# Altium project OpenDriver.PrjPCB
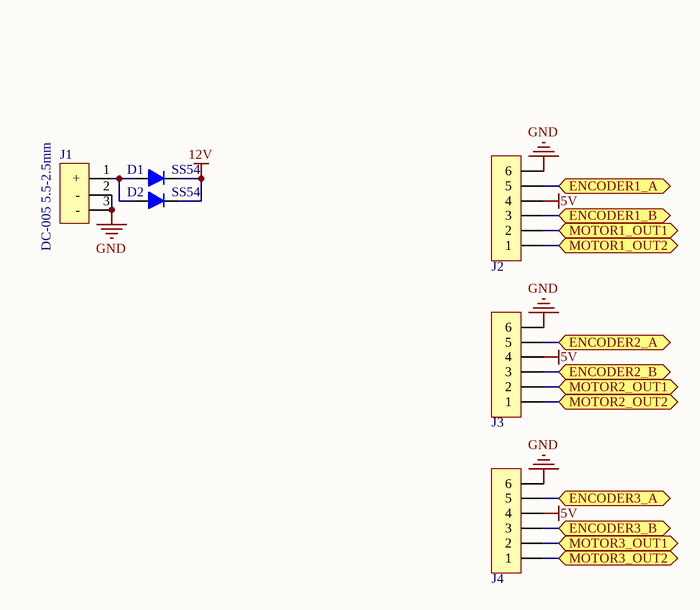
[diagram p0: OpenDriver.SchDoc]
5 sheets, 70 parts. Net scope: flat (ports and power ports of the same name join across sheets).
Board file: OpenDriver.PcbDoc
Sheets:
  OpenDriver.SchDoc
  CP2104.SchDoc
  A4950.SchDoc
  ArduinoDue.SchDoc
  MPU6050.SchDoc

## Sheet OpenDriver.SchDoc
size A4

### Parts
D1  SS54  [LC-SMA(DO-214AC)_S2]
D2  SS54  [LC-SMA(DO-214AC)_S2]
J1  DC-005 5.5-2.5mm  [DC10B]
J2  PH2.0-6P  [PH-6P]  (value not drawn)
J3  PH2.0-6P  [PH-6P]  (value not drawn)
J4  PH2.0-6P  [PH-6P]  (value not drawn)

### Ports
ENCODER1_A, ENCODER1_B, ENCODER2_A, ENCODER2_B, ENCODER3_A, ENCODER3_B, MOTOR1_OUT1, MOTOR1_OUT2, MOTOR2_OUT1, MOTOR2_OUT2, MOTOR3_OUT1, MOTOR3_OUT2

### Nets
5V: J2.4 J3.4 J4.4
12V: D1.2(K) D2.2(K)
GND: J1.2(-) J1.3(-) J2.6 J3.6 J4.6
NetD1_1: D1.1(A) D2.1(A) J1.1(+)
NetJ2_1: J2.1 ; port MOTOR1_OUT2
NetJ2_2: J2.2 ; port MOTOR1_OUT1
NetJ2_3: J2.3 ; port ENCODER1_B
NetJ2_5: J2.5 ; port ENCODER1_A
NetJ3_1: J3.1 ; port MOTOR2_OUT2
NetJ3_2: J3.2 ; port MOTOR2_OUT1
NetJ3_3: J3.3 ; port ENCODER2_B
NetJ3_5: J3.5 ; port ENCODER2_A
NetJ4_1: J4.1 ; port MOTOR3_OUT2
NetJ4_2: J4.2 ; port MOTOR3_OUT1
NetJ4_3: J4.3 ; port ENCODER3_B
NetJ4_5: J4.5 ; port ENCODER3_A

### Library data of the parts
D1 D2 = Diode1
J1 = DC-005
J2-J4 = PH2.0_6P

## Sheet CP2104.SchDoc
size A4
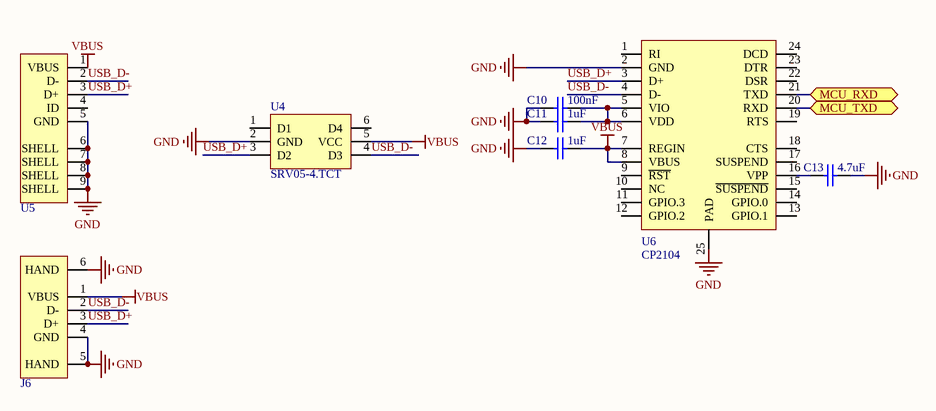
[diagram p1: CP2104.SchDoc]

### Parts
C10  value 100nF  [dq - 0402]  (hidden comment: Cap)
C11  value 1uF  [dq - 0402]  (hidden comment: Cap)
C12  value 1uF  [dq - 0402]  (hidden comment: Cap)
C13  value 4.7uF  [dq - 0603]  (hidden comment: Cap)
J6  USB  [USB-Square-Vertical]  (value not drawn)
U4  SRV05-4.TCT  [LC-SOT-23-6]
U5  Micro-USB-N  [MICRO-USB-F]  (value not drawn)
U6  CP2104  [QFN24 - T]

### Ports
MCU_RXD, MCU_TXD

### Nets
GND: C10.1 C11.1 C12.1 C13.2 J6.4(GND) J6.5(HAND) J6.6(HAND) U4.2(GND) U5.5(GND) U5.6(SHELL) U5.7(SHELL) U5.8(SHELL) U5.9(SHELL) U6.2(GND) U6.25(PAD)
VBUS: C12.2 J6.1(VBUS) U4.5(VCC) U5.1(VBUS) U6.7(REGIN) U6.8(VBUS)
USB_D+: J6.3(D+) U4.3(D2) U5.3(D+) U6.3(D+)
USB_D-: J6.2(D-) U4.4(D3) U5.2(D-) U6.4(D-)
NetC10_2: C10.2 C11.2 U6.5(VIO) U6.6(VDD)
NetC13_1: C13.1 U6.16(VPP)
NetU6_20: U6.20(RXD) ; port MCU_TXD
NetU6_21: U6.21(TXD) ; port MCU_RXD

Not connected (* = marked no-connect by the designer): U4 1(D1) 6(D4); U5 4(ID); U6 1(RI) 9(~{RST}) 10(NC) 11(GPIO.3) 12(GPIO.2) 13(GPIO.1) 14(GPIO.0) 15(~{SUSPEND}) 17(SUSPEND) 18(CTS) 19(RTS) 22(DSR) 23(DTR) 24(DCD)

### Library data of the parts
C10-C13 = DQ_Cap: Capacitor; Published: 8-Jun-2000; LatestRevisionDate: 17-Jul-2002; LatestRevisionNote: Re-released for DXP Platform.; PackageReference: RAD-0.3; Publisher: Altium Limited

## Sheet A4950.SchDoc
size A4
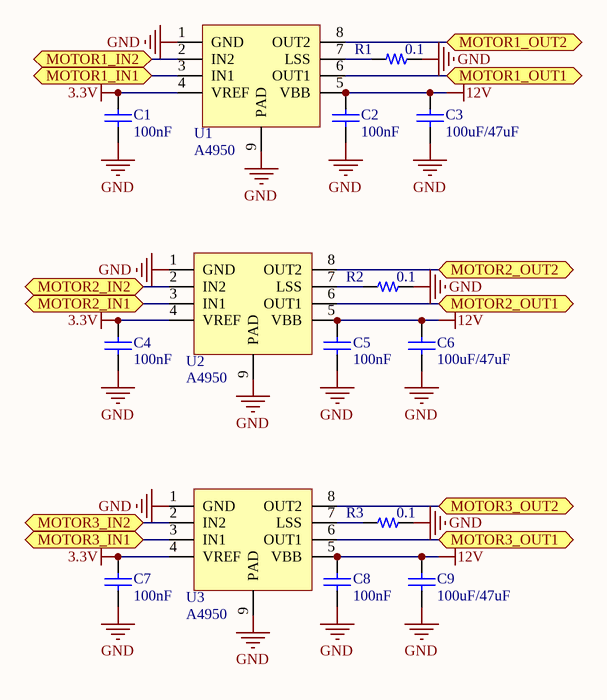
[diagram p2: A4950.SchDoc]

### Parts
C1  value 100nF  [dq - 0402]  (hidden comment: Cap)
C2  value 100nF  [dq - 0402]  (hidden comment: Cap)
C3  value 100uF/47uF  [dq - 1210]  (hidden comment: Cap)
C4  value 100nF  [dq - 0402]  (hidden comment: Cap)
C5  value 100nF  [dq - 0402]  (hidden comment: Cap)
C6  value 100uF/47uF  [dq - 1210]  (hidden comment: Cap)
C7  value 100nF  [dq - 0402]  (hidden comment: Cap)
C8  value 100nF  [dq - 0402]  (hidden comment: Cap)
C9  value 100uF/47uF  [dq - 1210]  (hidden comment: Cap)
R1  value 0.1  [DQ - 2512]  (hidden comment: Res)
R2  value 0.1  [DQ - 2512]  (hidden comment: Res)
R3  value 0.1  [DQ - 2512]  (hidden comment: Res)
U1  A4950  [LC-SOIC-8_150mil]
U2  A4950  [LC-SOIC-8_150mil]
U3  A4950  [LC-SOIC-8_150mil]

### Ports
MOTOR1_IN1, MOTOR1_IN2, MOTOR1_OUT1, MOTOR1_OUT2, MOTOR2_IN1, MOTOR2_IN2, MOTOR2_OUT1, MOTOR2_OUT2, MOTOR3_IN1, MOTOR3_IN2, MOTOR3_OUT1, MOTOR3_OUT2

### Nets
3.3V: C1.2 C4.2 C7.2 U1.4(VREF) U2.4(VREF) U3.4(VREF)
12V: C2.2 C3.2 C5.2 C6.2 C8.2 C9.2 U1.5(VBB) U2.5(VBB) U3.5(VBB)
GND: C1.1 C2.1 C3.1 C4.1 C5.1 C6.1 C7.1 C8.1 C9.1 R1.1 R2.1 R3.1 U1.1(GND) U1.9(PAD) U2.1(GND) U2.9(PAD) U3.1(GND) U3.9(PAD)
NetJ2_1: U1.8(OUT2) ; port MOTOR1_OUT2
NetJ2_2: U1.6(OUT1) ; port MOTOR1_OUT1
NetJ3_1: U2.8(OUT2) ; port MOTOR2_OUT2
NetJ3_2: U2.6(OUT1) ; port MOTOR2_OUT1
NetJ4_1: U3.8(OUT2) ; port MOTOR3_OUT2
NetJ4_2: U3.6(OUT1) ; port MOTOR3_OUT1
NetR1_2: R1.2 U1.7(LSS)
NetR2_2: R2.2 U2.7(LSS)
NetR3_2: R3.2 U3.7(LSS)
NetU1_2: U1.2(IN2) ; port MOTOR1_IN2
NetU1_3: U1.3(IN1) ; port MOTOR1_IN1
NetU2_2: U2.2(IN2) ; port MOTOR2_IN2
NetU2_3: U2.3(IN1) ; port MOTOR2_IN1
NetU3_2: U3.2(IN2) ; port MOTOR3_IN2
NetU3_3: U3.3(IN1) ; port MOTOR3_IN1

### Library data of the parts
C1-C9 = DQ_Cap: Capacitor; Published: 8-Jun-2000; LatestRevisionDate: 17-Jul-2002; LatestRevisionNote: Re-released for DXP Platform.; PackageReference: RAD-0.3; Publisher: Altium Limited
R1-R3 = DQ_Res: Resistance

## Sheet ArduinoDue.SchDoc
size A4
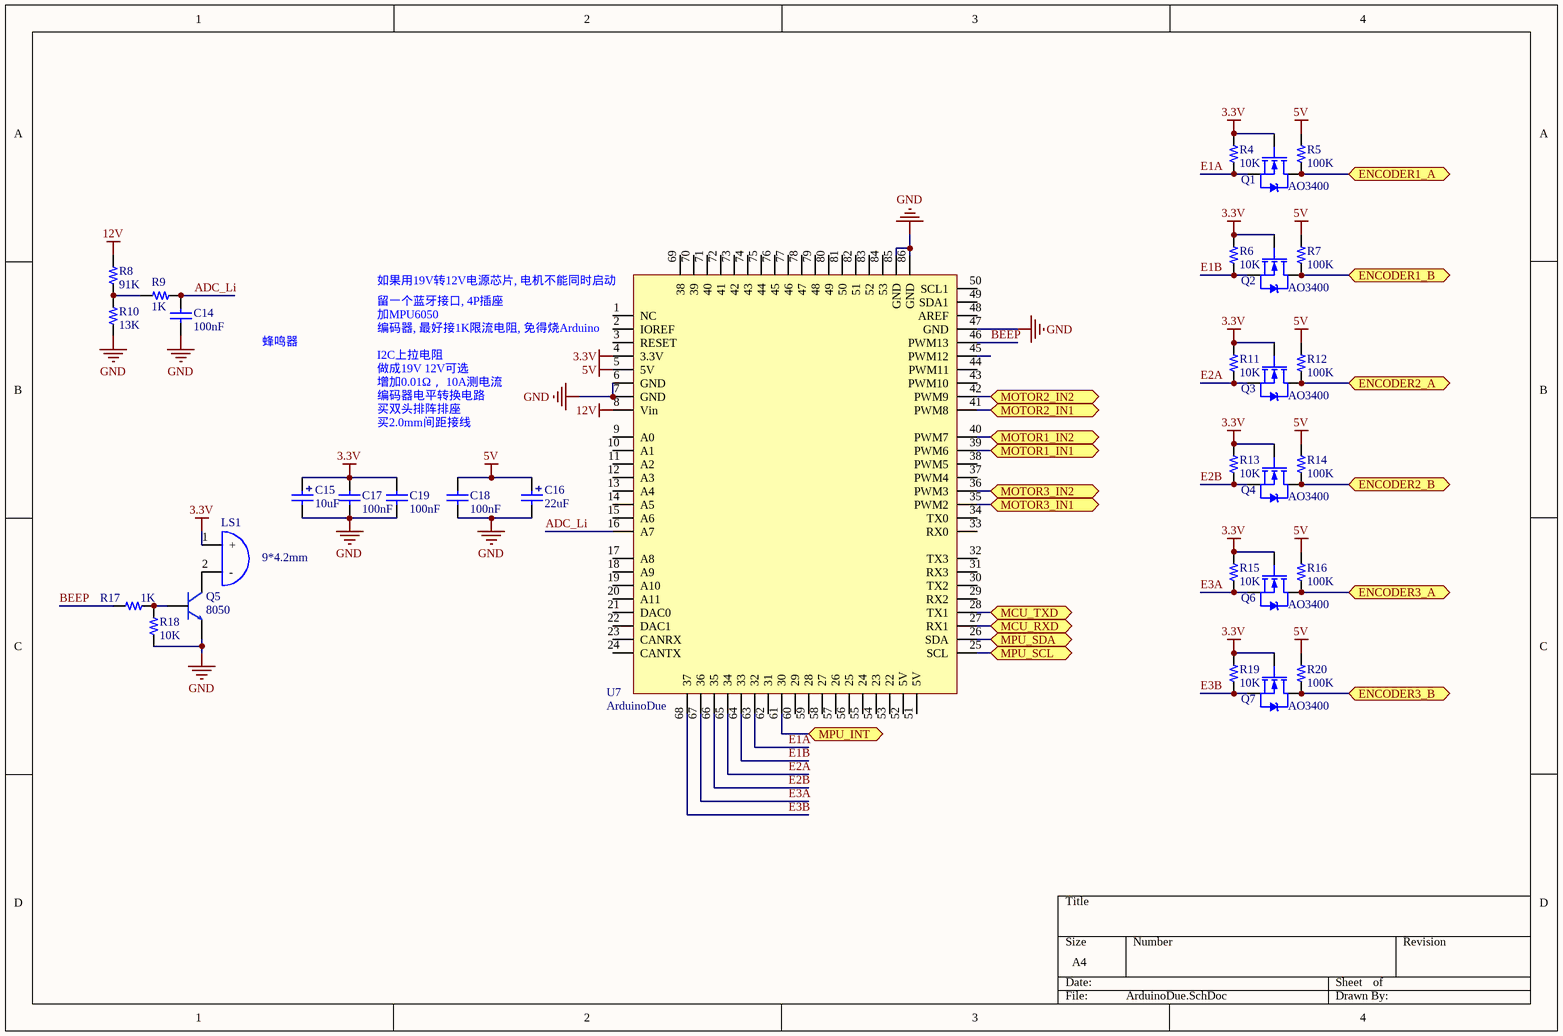
[diagram p3: ArduinoDue.SchDoc]

### Parts
C14  value 100nF  [dq - 0402]  (hidden comment: Cap)
C15  value 10uF  [3216-18]  (hidden comment: Cap_Pol)
C16  value 22uF  [3528-21]  (hidden comment: Cap_Pol)
C17  value 100nF  [dq - 0402]  (hidden comment: Cap)
C18  value 100nF  [dq - 0402]  (hidden comment: Cap)
C19  value 100nF  [dq - 0402]  (hidden comment: Cap)
LS1  9*4.2mm  [BUZZER-9*4.2MM]
Q1  AO3400  [SOT-23-3 - AO3400]
Q2  AO3400  [SOT-23-3 - AO3400]
Q3  AO3400  [SOT-23-3 - AO3400]
Q4  AO3400  [SOT-23-3 - AO3400]
Q5  8050  [SOT-23-3]
Q6  AO3400  [SOT-23-3 - AO3400]
Q7  AO3400  [SOT-23-3 - AO3400]
R4  value 10K  [dq - 0402]  (hidden comment: Res)
R5  value 100K  [dq - 0402]  (hidden comment: Res)
R6  value 10K  [dq - 0402]  (hidden comment: Res)
R7  value 100K  [dq - 0402]  (hidden comment: Res)
R8  value 91K  [dq - 0402]  (hidden comment: Res)
R9  value 1K  [dq - 0402]  (hidden comment: Res)
R10  value 13K  [dq - 0402]  (hidden comment: Res)
R11  value 10K  [dq - 0402]  (hidden comment: Res)
R12  value 100K  [dq - 0402]  (hidden comment: Res)
R13  value 10K  [dq - 0402]  (hidden comment: Res)
R14  value 100K  [dq - 0402]  (hidden comment: Res)
R15  value 10K  [dq - 0402]  (hidden comment: Res)
R16  value 100K  [dq - 0402]  (hidden comment: Res)
R17  value 1K  [dq - 0402]  (hidden comment: Res)
R18  value 10K  [dq - 0402]  (hidden comment: Res)
R19  value 10K  [dq - 0402]  (hidden comment: Res)
R20  value 100K  [dq - 0402]  (hidden comment: Res)
U7  ArduinoDue  [ArduinoDue]

### Ports
ENCODER1_A, ENCODER1_B, ENCODER2_A, ENCODER2_B, ENCODER3_A, ENCODER3_B, MCU_RXD, MCU_TXD, MOTOR1_IN1, MOTOR1_IN2, MOTOR2_IN1, MOTOR2_IN2, MOTOR3_IN1, MOTOR3_IN2, MPU_INT, MPU_SCL, MPU_SDA

### Nets
3.3V: C15.1 C17.2 C19.2 LS1.1(+) Q1.1(G) Q2.1(G) Q3.1(G) Q4.1(G) Q6.1(G) Q7.1(G) R4.1 R6.1 R11.1 R13.1 R15.1 R19.1 U7.4(3.3V)
5V: C16.1 C18.2 R5.1 R7.1 R12.1 R14.1 R16.1 R20.1 U7.5(5V)
12V: R8.1 U7.8(Vin)
GND: C14.1 C15.2 C16.2 C17.1 C18.1 C19.1 Q5.1(e) R10.2 R18.2 U7.6(GND) U7.7(GND) U7.47(GND) U7.85(GND) U7.86(GND)
ADC_Li: C14.2 R9.2 U7.16(A7)
BEEP: R17.2 U7.46(PWM13)
E1A: Q1.3(S) R4.2 U7.63(32)
E1B: Q2.3(S) R6.2 U7.64(33)
E2A: Q3.3(S) R11.2 U7.65(34)
E2B: Q4.3(S) R13.2 U7.66(35)
E3A: Q6.3(S) R15.2 U7.67(36)
E3B: Q7.3(S) R19.2 U7.68(37)
NetJ2_3: Q2.2(D) R7.2 ; port ENCODER1_B
NetJ2_5: Q1.2(D) R5.2 ; port ENCODER1_A
NetJ3_3: Q4.2(D) R14.2 ; port ENCODER2_B
NetJ3_5: Q3.2(D) R12.2 ; port ENCODER2_A
NetJ4_3: Q7.2(D) R20.2 ; port ENCODER3_B
NetJ4_5: Q6.2(D) R16.2 ; port ENCODER3_A
NetLS1_2: LS1.2(-) Q5.3(c)
NetQ5_2: Q5.2(b) R17.1 R18.1
NetR8_2: R8.2 R9.1 R10.1
NetR21_2: U7.25(SCL) ; port MPU_SCL
NetR22_2: U7.26(SDA) ; port MPU_SDA
NetU1_2: U7.40(PWM7) ; port MOTOR1_IN2
NetU1_3: U7.39(PWM6) ; port MOTOR1_IN1
NetU2_2: U7.42(PWM9) ; port MOTOR2_IN2
NetU2_3: U7.41(PWM8) ; port MOTOR2_IN1
NetU3_2: U7.36(PWM3) ; port MOTOR3_IN2
NetU3_3: U7.35(PWM2) ; port MOTOR3_IN1
NetU6_20: U7.28(TX1) ; port MCU_TXD
NetU6_21: U7.27(RX1) ; port MCU_RXD
NetU7_61: U7.61(30) ; port MPU_INT

Not connected (* = marked no-connect by the designer): U7 1(NC) 2(IOREF) 3(RESET) 9(A0) 10(A1) 11(A2) 12(A3) 13(A4) 14(A5) 15(A6) 17(A8) 18(A9) 19(A10) 20(A11) 21(DAC0) 22(DAC1) 23(CANRX) 24(CANTX) 29(RX2) 30(TX2) 31(RX3) 32(TX3) 33(RX0) 34(TX0) 37(PWM4) 38(PWM5) 43(PWM10) 44(PWM11) 45(PWM12) 48(AREF) 49(SDA1) 50(SCL1) 51(5V) 52(5V) 53(22) 54(23) 55(24) 56(25) 57(26) 58(27) 59(28) 60(29) 62(31) 69(38) 70(39) 71(40) 72(41) 73(42) 74(43) 75(44) 76(45) 77(46) 78(47) 79(48) 80(49) 81(50) 82(51) 83(52) 84(53)

### Notes on the sheet
- 留一个蓝牙接口, 4P插座
- 如果用19V转12V电源芯片, 电机不能同时启动
- 蜂鸣器
- 加MPU6050
- 编码器, 最好接1K限流电阻, 免得烧Arduino
- I2C上拉电阻
- 做成19V 12V可选
- 增加0.01Ω， 10A测电流
- 编码器电平转换电路
- 买双头排阵排座
- 买2.0mm间距接线

### Library data of the parts
C14 C17-C19 = DQ_Cap: Capacitor; Published: 8-Jun-2000; LatestRevisionDate: 17-Jul-2002; LatestRevisionNote: Re-released for DXP Platform.; PackageReference: RAD-0.3; Publisher: Altium Limited
C15 C16 = Cap_Pol: Capacitor; Published: 8-Jun-2000; LatestRevisionDate: 17-Jul-2002; LatestRevisionNote: Re-released for DXP Platform.; PackageReference: RAD-0.3; Publisher: Altium Limited
LS1 = Buzzer_1: Electrical Bell; Published: 24-Mar-1999; LatestRevisionDate: 17-Jul-2002; LatestRevisionNote: Re-released for DXP Platform.; PackageReference: PIN2; Publisher: Altium Limited
Q1-Q4 Q6 Q7 = NMOS: N-Channel Power MOSFET; Note: Pin 2 is electrically connected to pin 4.; Published: 8-Jun-2000; LatestRevisionDate: 17-Jul-2002; LatestRevisionNote: Re-released for DXP Platform.; DatasheetDocument: PD-9.814; PackageReference: TO-220AB; Publisher: Altium Limited; Code_JEDEC: TO-220-AB; ComponentLink1Description: Manufacturer Link; ComponentLink1URL: http://www.irf.com/
Q5 = NPN
R4-R20 = DQ_Res: Resistance

## Sheet MPU6050.SchDoc
size A4
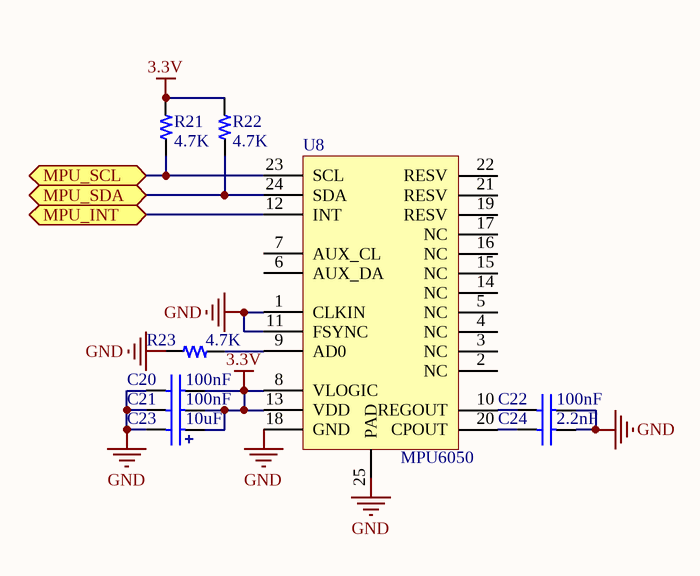
[diagram p4: MPU6050.SchDoc]

### Parts
C20  value 100nF  [dq - 0402]  (hidden comment: Cap)
C21  value 100nF  [dq - 0402]  (hidden comment: Cap)
C22  value 100nF  [dq - 0402]  (hidden comment: Cap)
C23  value 10uF  [3216-18]  (hidden comment: Cap_Pol)
C24  value 2.2nF  [dq - 0402]  (hidden comment: Cap)
R21  value 4.7K  [dq - 0402]  (hidden comment: Res)
R22  value 4.7K  [dq - 0402]  (hidden comment: Res)
R23  value 4.7K  [dq - 0402]  (hidden comment: Res)
U8  MPU6050  [QFN-24]

### Ports
MPU_INT, MPU_SCL, MPU_SDA

### Nets
3.3V: C20.2 C21.2 C23.1 R21.1 R22.1 U8.8(VLOGIC) U8.13(VDD)
GND: C20.1 C21.1 C22.2 C23.2 C24.2 R23.1 U8.1(CLKIN) U8.11(FSYNC) U8.18(GND) U8.25(PAD)
NetC22_1: C22.1 U8.10(REGOUT)
NetC24_1: C24.1 U8.20(CPOUT)
NetR21_2: R21.2 U8.23(SCL) ; port MPU_SCL
NetR22_2: R22.2 U8.24(SDA) ; port MPU_SDA
NetR23_2: R23.2 U8.9(AD0)
NetU7_61: U8.12(INT) ; port MPU_INT

Not connected (* = marked no-connect by the designer): U8 2(NC) 3(NC) 4(NC) 5(NC) 6(AUX_DA) 7(AUX_CL) 14(NC) 15(NC) 16(NC) 17(NC) 19(RESV) 21(RESV) 22(RESV)

### Library data of the parts
C20-C22 C24 = DQ_Cap: Capacitor; Published: 8-Jun-2000; LatestRevisionDate: 17-Jul-2002; LatestRevisionNote: Re-released for DXP Platform.; PackageReference: RAD-0.3; Publisher: Altium Limited
C23 = Cap_Pol: Capacitor; Published: 8-Jun-2000; LatestRevisionDate: 17-Jul-2002; LatestRevisionNote: Re-released for DXP Platform.; PackageReference: RAD-0.3; Publisher: Altium Limited
R21-R23 = DQ_Res: Resistance

## Nets that join several sheets
3.3V: A4950 (6 pins), ArduinoDue (17 pins), MPU6050 (7 pins)
5V: OpenDriver (J2.4 J3.4 J4.4), ArduinoDue (9 pins)
12V: OpenDriver (D1.2 D2.2), A4950 (9 pins), ArduinoDue (R8.1 U7.8)
GND: OpenDriver (5 pins), CP2104 (15 pins), A4950 (18 pins), ArduinoDue (14 pins), MPU6050 (10 pins)
NetJ2_1: OpenDriver (J2.1), A4950 (U1.8)
NetJ2_2: OpenDriver (J2.2), A4950 (U1.6)
NetJ2_3: OpenDriver (J2.3), ArduinoDue (Q2.2 R7.2)
NetJ2_5: OpenDriver (J2.5), ArduinoDue (Q1.2 R5.2)
NetJ3_1: OpenDriver (J3.1), A4950 (U2.8)
NetJ3_2: OpenDriver (J3.2), A4950 (U2.6)
NetJ3_3: OpenDriver (J3.3), ArduinoDue (Q4.2 R14.2)
NetJ3_5: OpenDriver (J3.5), ArduinoDue (Q3.2 R12.2)
NetJ4_1: OpenDriver (J4.1), A4950 (U3.8)
NetJ4_2: OpenDriver (J4.2), A4950 (U3.6)
NetJ4_3: OpenDriver (J4.3), ArduinoDue (Q7.2 R20.2)
NetJ4_5: OpenDriver (J4.5), ArduinoDue (Q6.2 R16.2)
NetR21_2: ArduinoDue (U7.25), MPU6050 (R21.2 U8.23)
NetR22_2: ArduinoDue (U7.26), MPU6050 (R22.2 U8.24)
NetU1_2: A4950 (U1.2), ArduinoDue (U7.40)
NetU1_3: A4950 (U1.3), ArduinoDue (U7.39)
NetU2_2: A4950 (U2.2), ArduinoDue (U7.42)
NetU2_3: A4950 (U2.3), ArduinoDue (U7.41)
NetU3_2: A4950 (U3.2), ArduinoDue (U7.36)
NetU3_3: A4950 (U3.3), ArduinoDue (U7.35)
NetU6_20: CP2104 (U6.20), ArduinoDue (U7.28)
NetU6_21: CP2104 (U6.21), ArduinoDue (U7.27)
NetU7_61: ArduinoDue (U7.61), MPU6050 (U8.12)